# EAGLE design flight_unit (EAGLE 9.5.1)

## Sheet 1 of 6
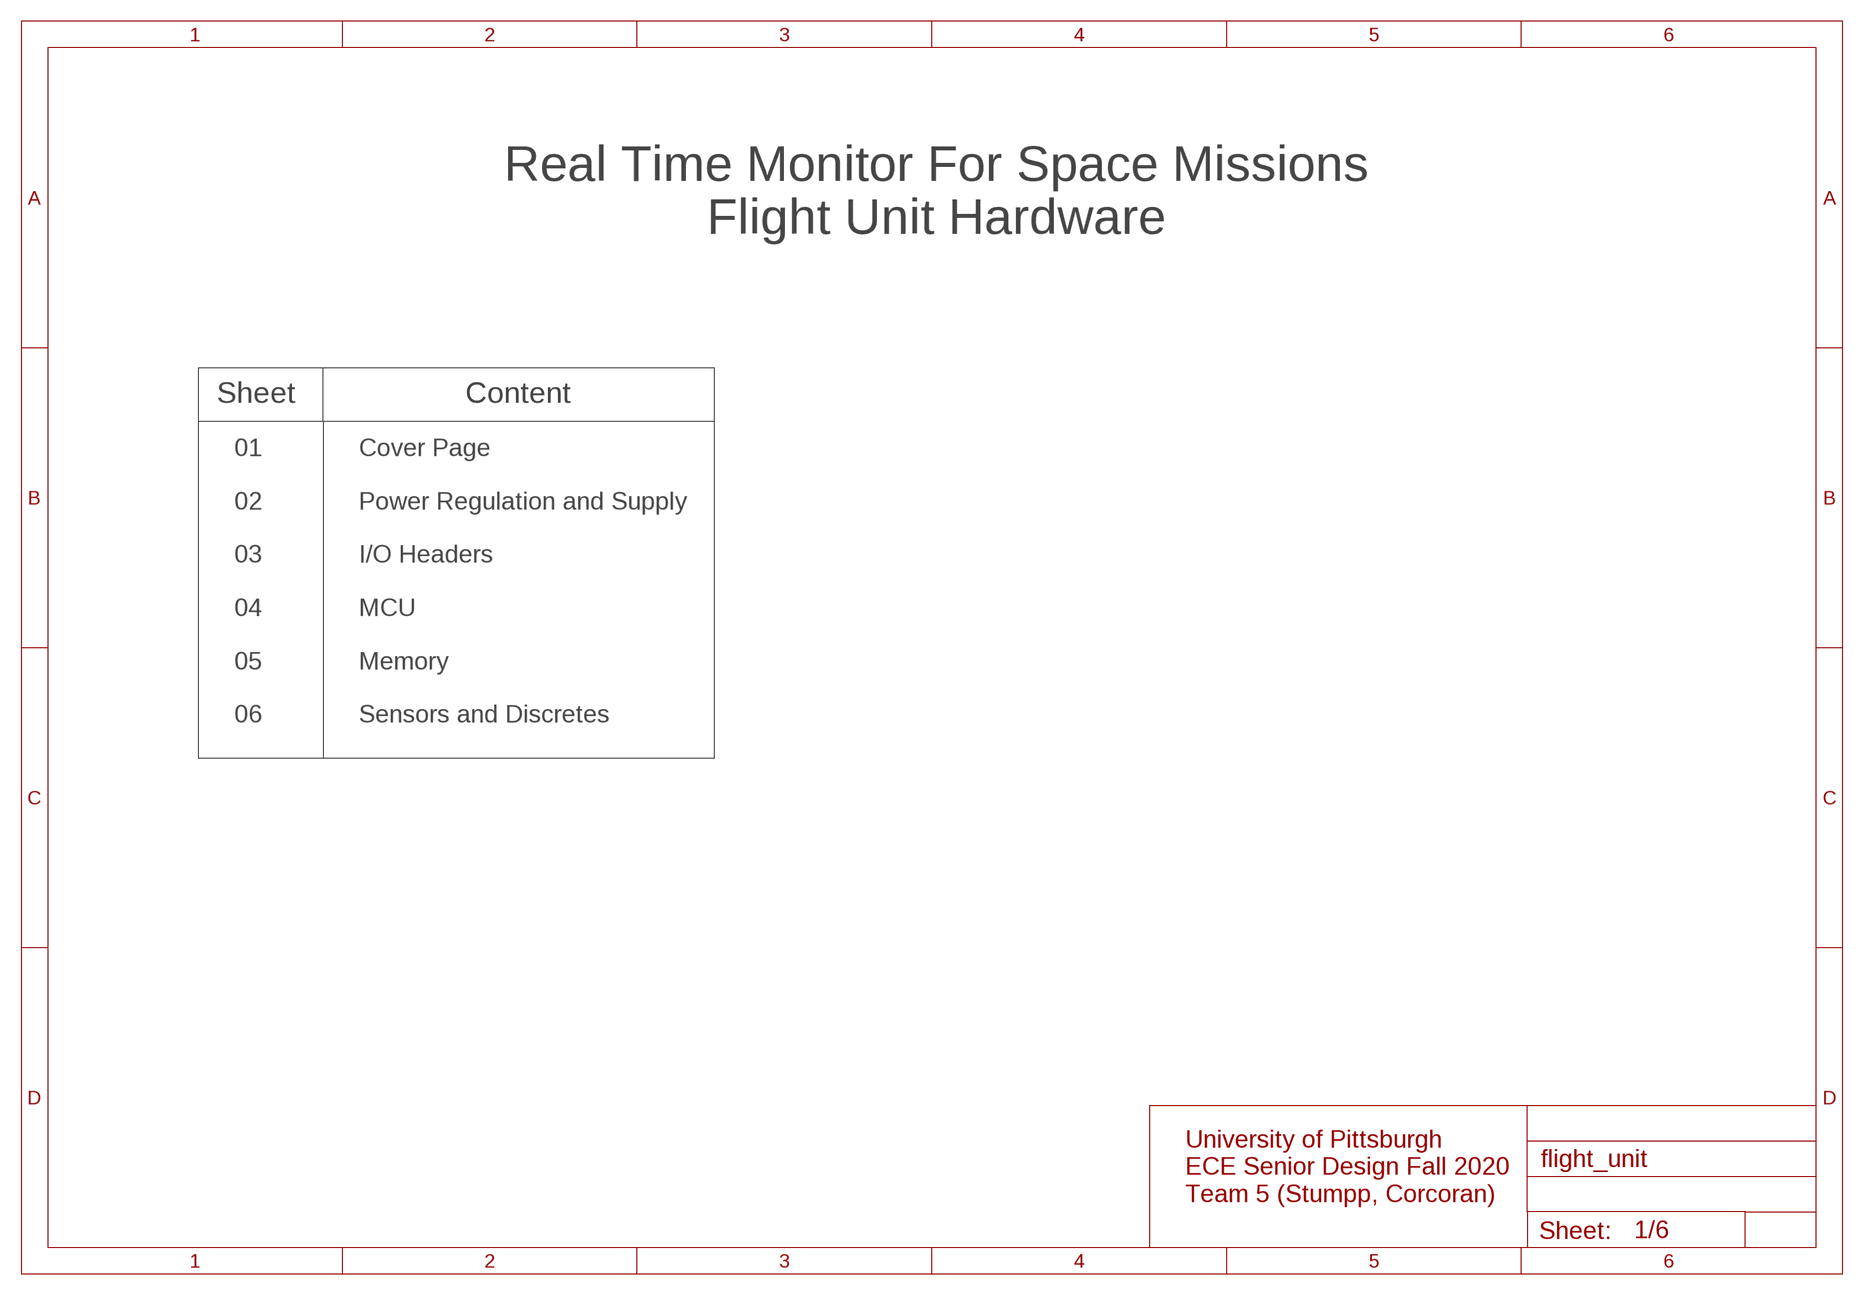
[diagram p0: schematic, sheet 1]

### Notes on the sheet
- Real Time Monitor For Space Missions
  Flight Unit Hardware
- Sheet | Content
- 01
  
  02
  
  03
  
  04
  
  05
  
  06
- Cover Page
  
  Power Regulation and Supply
  
  I/O Headers
  
  MCU
  
  Memory
  
  Sensors and Discretes
- University of Pittsburgh 
  ECE Senior Design Fall 2020
  Team 5 (Stumpp, Corcoran)

## Sheet 2 of 6
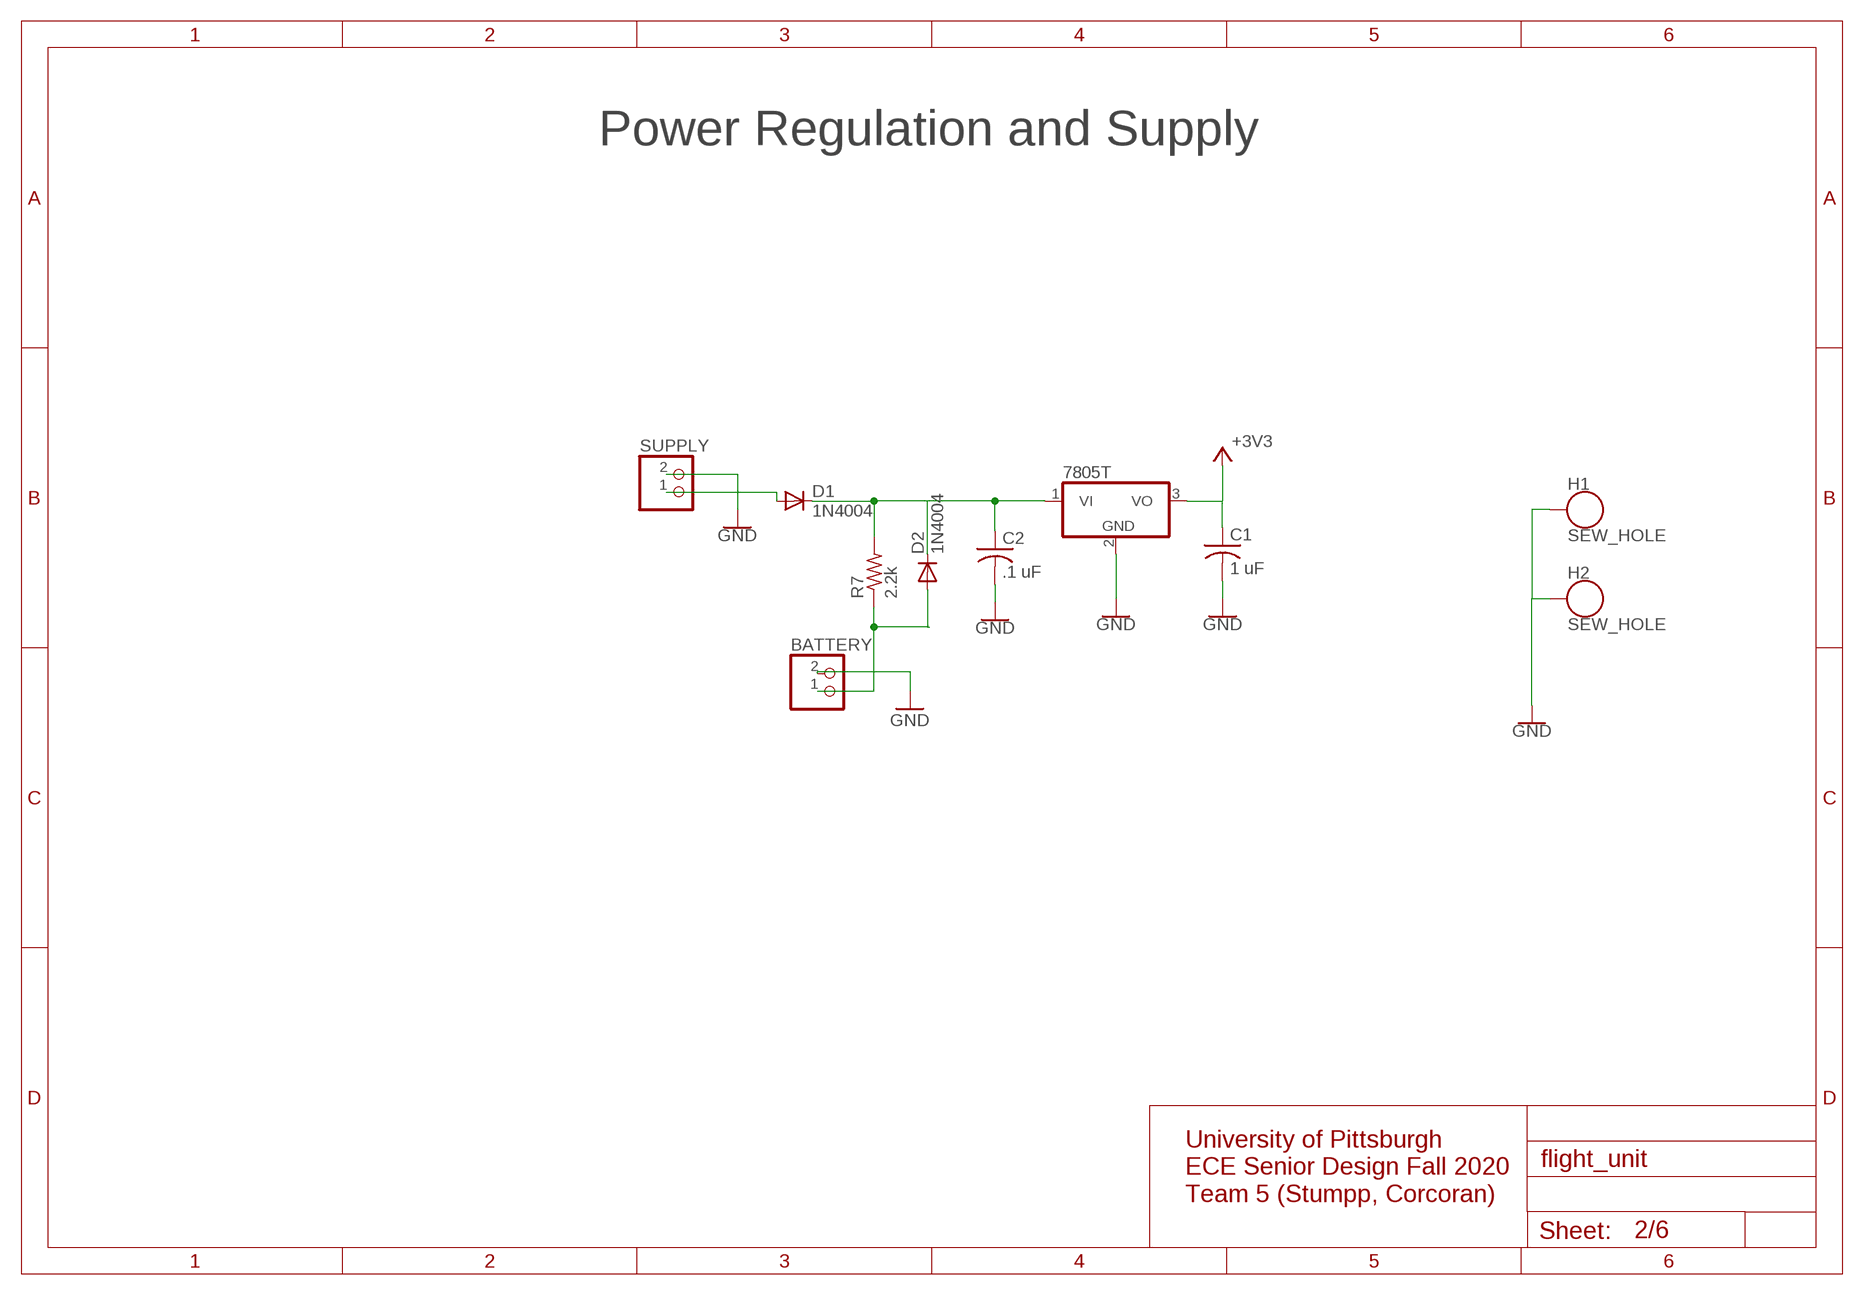
[diagram p1: schematic, sheet 2]

### Parts
BATTERY  JST_2PIN-THM  [JST-PH-2-THM]
C1  1 uF  C-USC0805K  [C0805K]
C2  .1 uF  C-USC0805K  [C0805K]
D1  1N4004  [DO41-10]
D2  1N4004  [DO41-10]
H1  SEW_HOLE  [SIMPLE_HOLE]
H2  SEW_HOLE  [SIMPLE_HOLE]
IC2  7805T  [TO220H]
R7  2.2k  R-US_R0805  [R0805]
SUPPLY  JST_2PIN-THM  [JST-PH-2-THM]

### Nets
+3V3: C1.1 IC2.3(VO) ; also sheet 4,5,6
GND: BATTERY.2 C1.2 C2.2 H1.P$1 H2.P$1 IC2.2(GND) SUPPLY.2 ; also sheet 3,4,5,6
N$1: BATTERY.1 D2.A R7.1
N$2: C2.1 D1.C D2.C IC2.1(VI) R7.2
N$4: D1.A SUPPLY.1

### Notes on the sheet
- Power Regulation and Supply
- University of Pittsburgh 
  ECE Senior Design Fall 2020
  Team 5 (Stumpp, Corcoran)

## Sheet 3 of 6
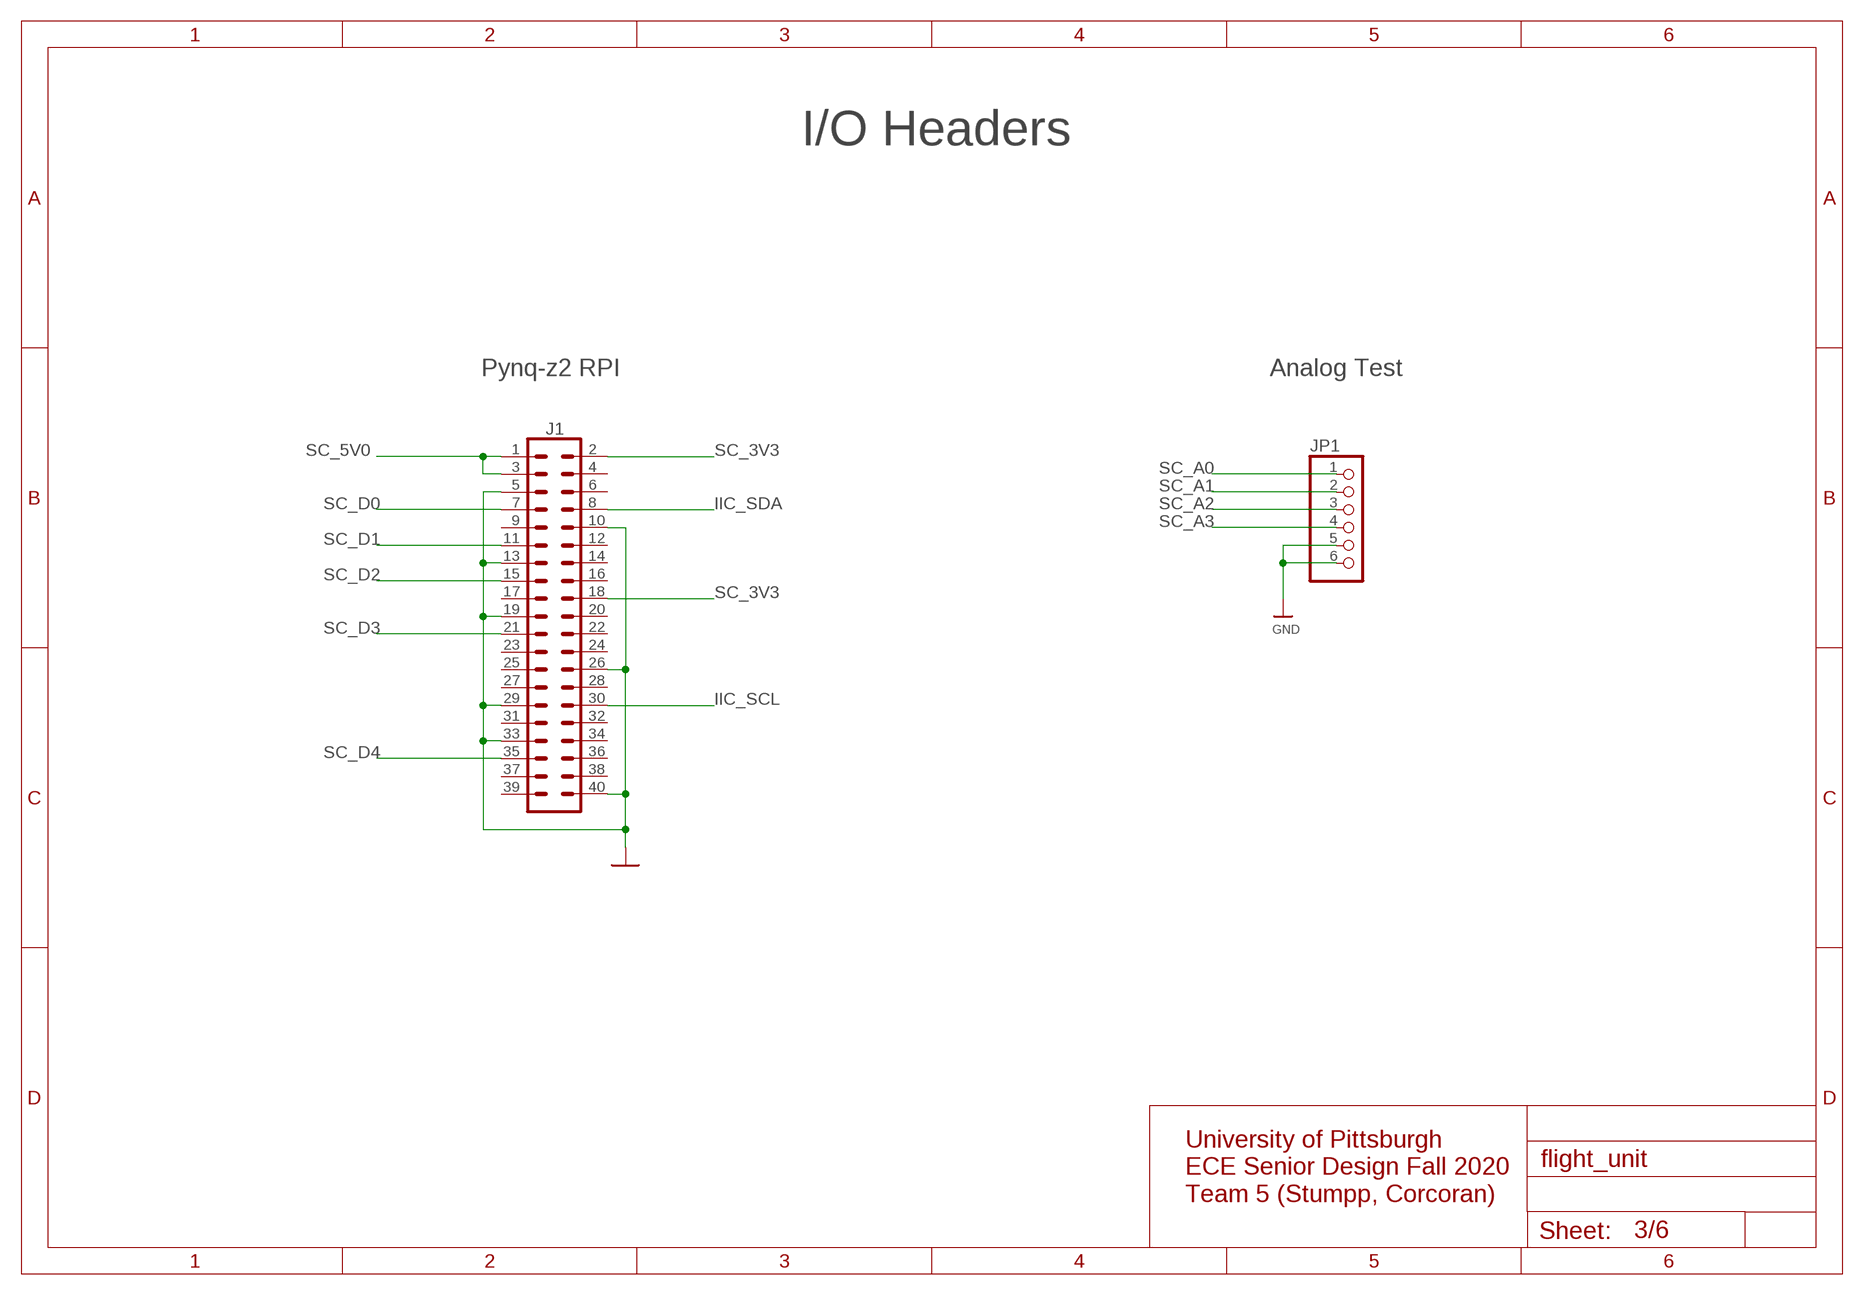
[diagram p2: schematic, sheet 3]

### Parts
J1  CONN_20X2SHROUDED  [2X20_SHROUDED]
JP1  PINHD-1X6B  [1X06-BIG]

### Nets
GND: J1.5 J1.10 J1.13 J1.19 J1.26 J1.29 J1.33 J1.40 JP1.5 JP1.6 ; also sheet 2,4,5,6
IIC_SCL: J1.30 ; also sheet 4,6
IIC_SDA: J1.8 ; also sheet 4,6
SC_3V3: J1.2 J1.18 ; also sheet 6
SC_5V0: J1.1 J1.3 ; also sheet 6
SC_A0: JP1.1 ; also sheet 6
SC_A1: JP1.2 ; also sheet 6
SC_A2: JP1.3 ; also sheet 6
SC_A3: JP1.4 ; also sheet 6
SC_D0: J1.7 ; also sheet 4
SC_D1: J1.11 ; also sheet 4
SC_D2: J1.15 ; also sheet 4
SC_D3: J1.21 ; also sheet 4
SC_D4: J1.35 ; also sheet 4
Unconnected: J1.4 J1.6 J1.9 J1.12 J1.14 J1.16 J1.17 J1.20 J1.22 J1.23 J1.24 J1.25 J1.27 J1.28 J1.31 J1.32 J1.34 J1.36 J1.37 J1.38 J1.39

### Notes on the sheet
- I/O Headers
- Pynq-z2 RPI | Analog Test
- University of Pittsburgh 
  ECE Senior Design Fall 2020
  Team 5 (Stumpp, Corcoran)

## Sheet 4 of 6
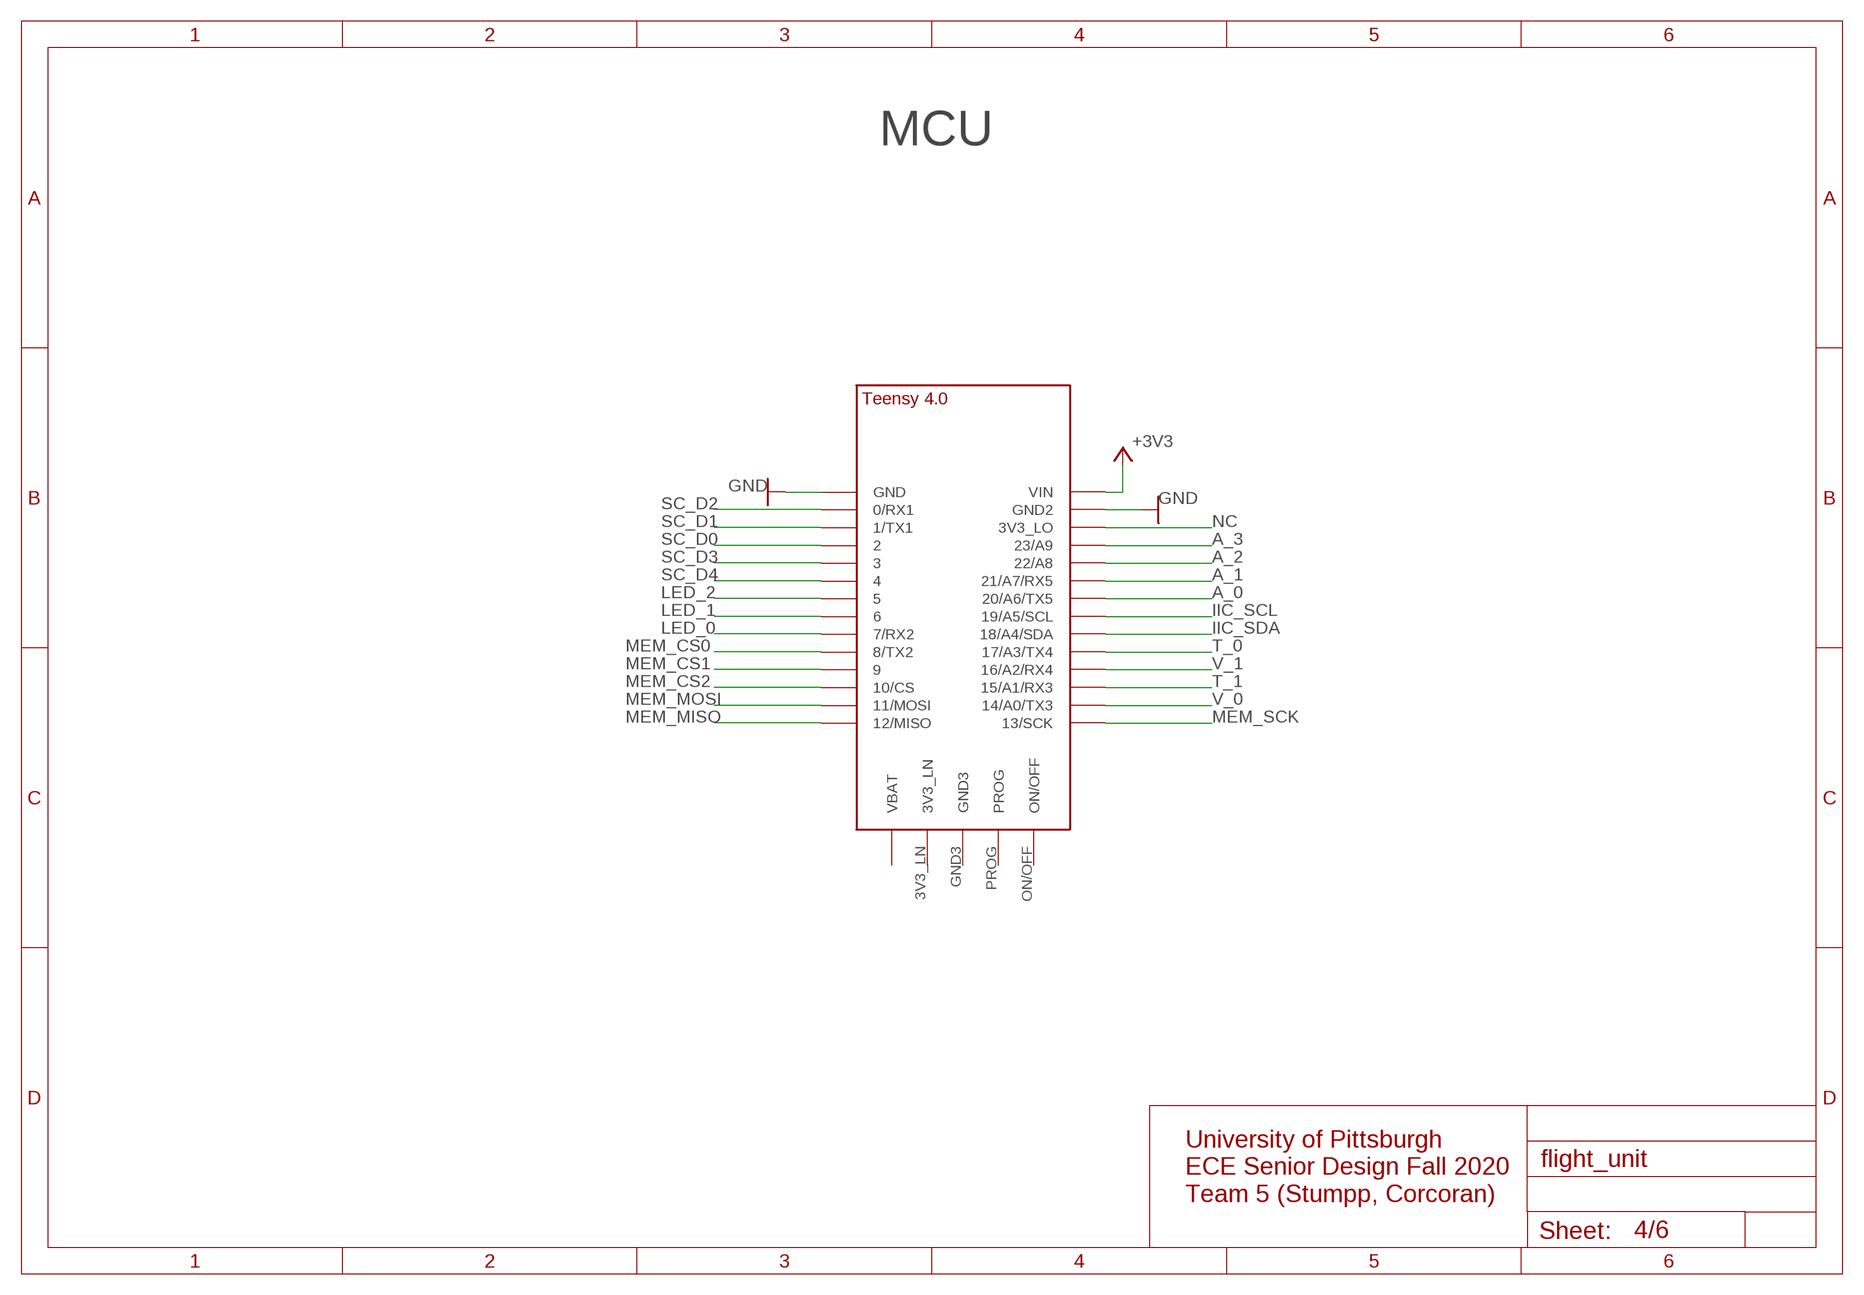
[diagram p3: schematic, sheet 4]

### Parts
U$1  TEENSY_4.0  [TEENSY_4.0]

### Nets
+3V3: U$1.VIN ; also sheet 2,5,6
A_0: U$1.20/A6(20/A6/TX5) ; also sheet 6
A_1: U$1.21/A7(21/A7/RX5) ; also sheet 6
A_2: U$1.22/A8 ; also sheet 6
A_3: U$1.23/A9 ; also sheet 6
GND: U$1.GND U$1.GND2 ; also sheet 2,3,5,6
IIC_SCL: U$1.19/A5/SCL ; also sheet 3,6
IIC_SDA: U$1.18/A4/SDA ; also sheet 3,6
LED_0: U$1.7(7/RX2) ; also sheet 6
LED_1: U$1.6 ; also sheet 6
LED_2: U$1.5 ; also sheet 6
MEM_CS0: U$1.8(8/TX2) ; also sheet 5
MEM_CS1: U$1.9/CS ; also sheet 5
MEM_CS2: U$1.10/CS ; also sheet 5
MEM_MISO: U$1.12/MISO ; also sheet 5
MEM_MOSI: U$1.11/MOSI ; also sheet 5
MEM_SCK: U$1.13/SCK ; also sheet 5
NC: U$1.3V3_LO
SC_D0: U$1.2 ; also sheet 3
SC_D1: U$1.1/TX(1/TX1) ; also sheet 3
SC_D2: U$1.0/RX(0/RX1) ; also sheet 3
SC_D3: U$1.3/CANTX ; also sheet 3
SC_D4: U$1.4/CANRX ; also sheet 3
T_0: U$1.17/A3(17/A3/TX4) ; also sheet 6
T_1: U$1.15/A1(15/A1/RX3) ; also sheet 6
V_0: U$1.14/A0(14/A0/TX3) ; also sheet 6
V_1: U$1.16/A2(16/A2/RX4) ; also sheet 6
Unconnected: U$1.3V3_LN U$1.GND3 U$1.ON/OFF U$1.PROG U$1.VBAT\(VBAT)

### Notes on the sheet
- MCU
- University of Pittsburgh 
  ECE Senior Design Fall 2020
  Team 5 (Stumpp, Corcoran)

## Sheet 5 of 6
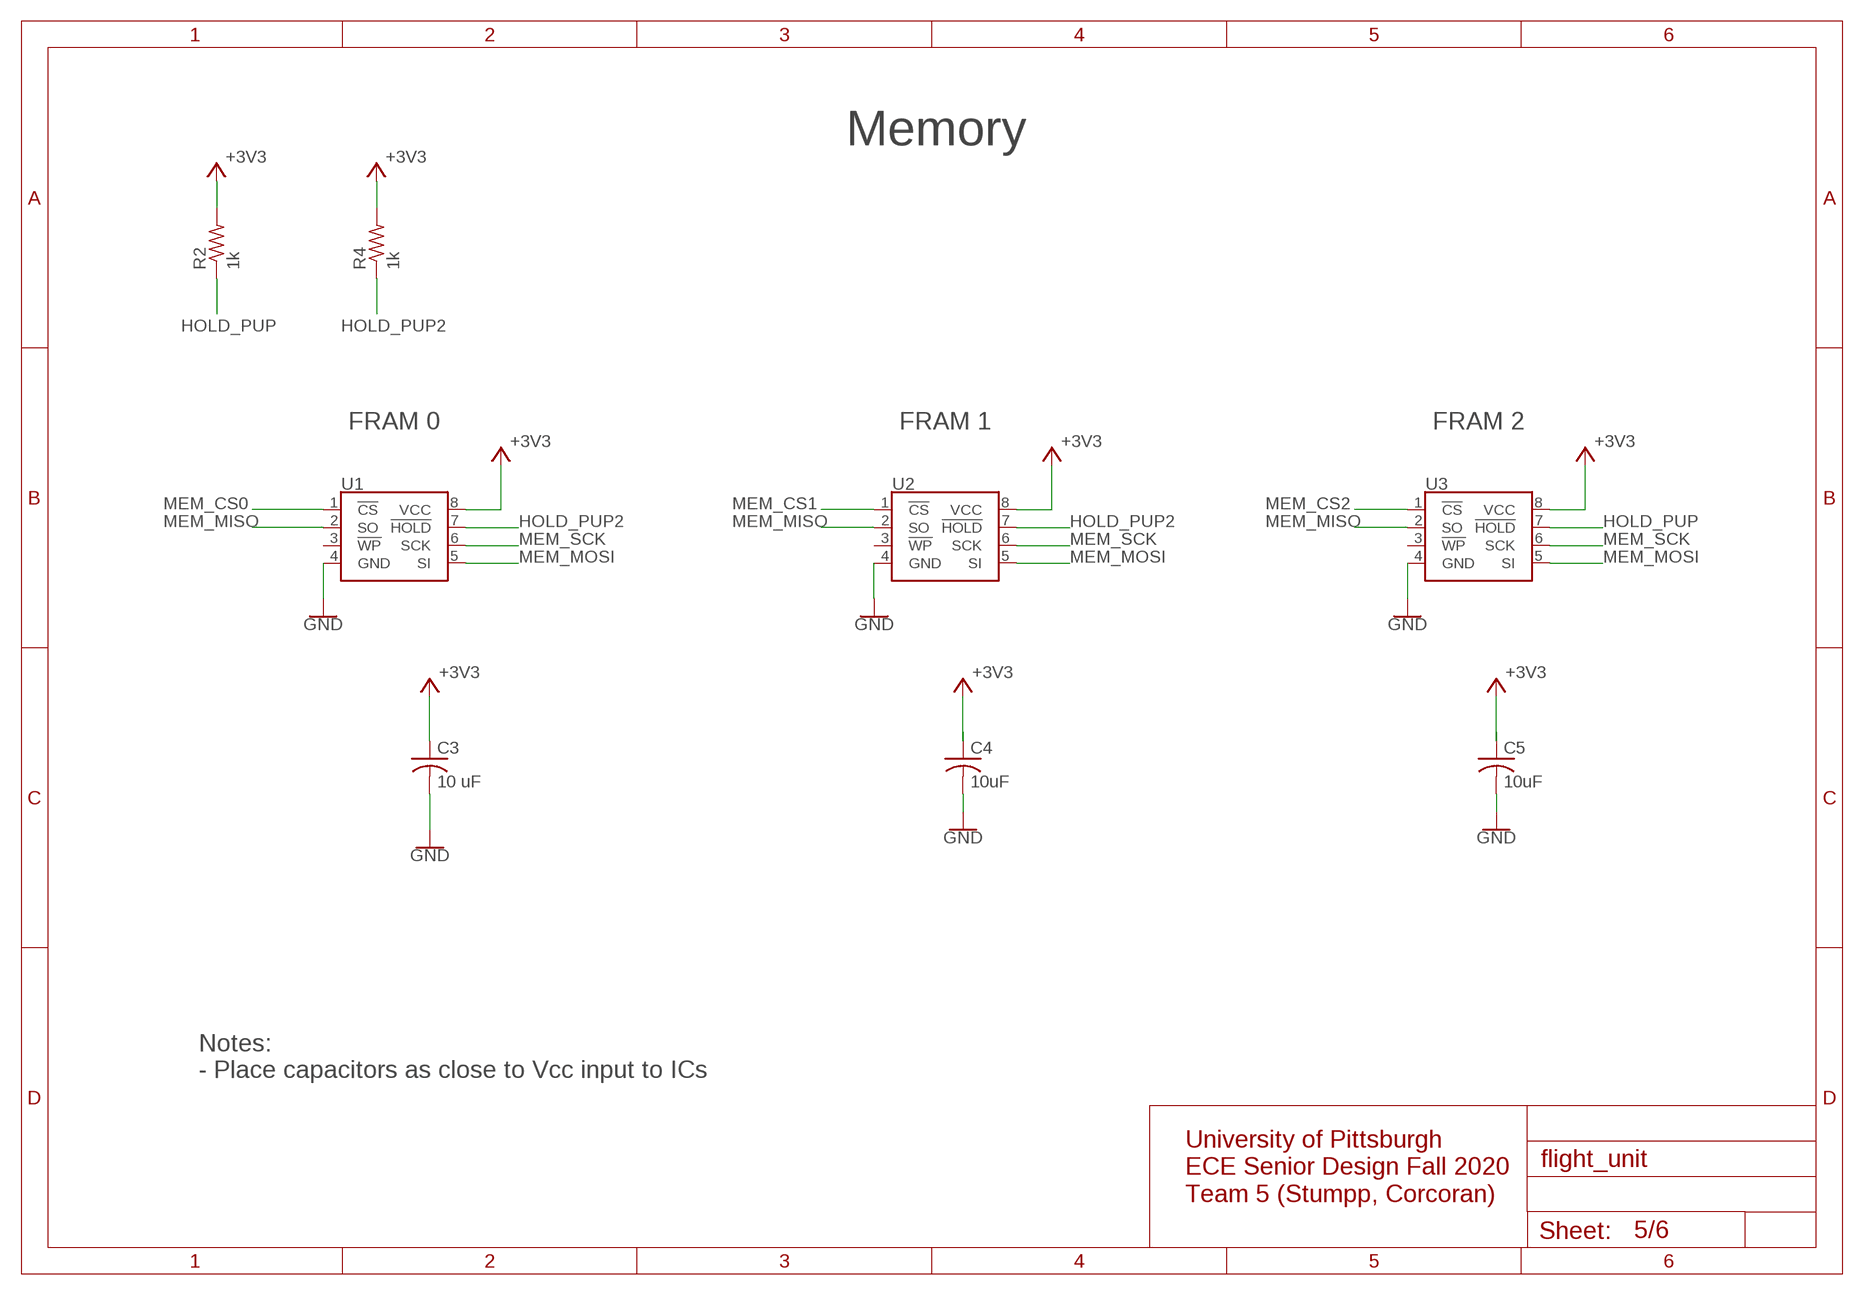
[diagram p4: schematic, sheet 5]

### Parts
C3  10 uF  C-USC0805K  [C0805K]
C4  10uF  C-USC0805K  [C0805K]
C5  10uF  C-USC0805K  [C0805K]
R2  1k  R-US_R0805  [R0805]
R4  1k  R-US_R0805  [R0805]
U1  4MB Flash  AT25SF041  [SO08]
U2  4MB Flash  AT25SF041  [SO08]
U3  4MB Flash  AT25SF041  [SO08]

### Nets
+3V3: C3.1 C4.1 C5.1 R2.2 R4.2 U1.8(VCC) U2.8(VCC) U3.8(VCC) ; also sheet 2,4,6
GND: C3.2 C4.2 C5.2 U1.4(GND) U2.4(GND) U3.4(GND) ; also sheet 2,3,4,6
HOLD_PUP: R2.1 U3.7(!HOLD)
HOLD_PUP2: R4.1 U1.7(!HOLD) U2.7(!HOLD)
MEM_CS0: U1.1(!CS) ; also sheet 4
MEM_CS1: U2.1(!CS) ; also sheet 4
MEM_CS2: U3.1(!CS) ; also sheet 4
MEM_MISO: U1.2(SO) U2.2(SO) U3.2(SO) ; also sheet 4
MEM_MOSI: U1.5(SI) U2.5(SI) U3.5(SI) ; also sheet 4
MEM_SCK: U1.6(SCK) U2.6(SCK) U3.6(SCK) ; also sheet 4
Unconnected: U1.3(!WP) U2.3(!WP) U3.3(!WP)

### Notes on the sheet
- Memory
- FRAM 0 | FRAM 1 | FRAM 2
- Notes:
  - Place capacitors as close to Vcc input to ICs
- University of Pittsburgh 
  ECE Senior Design Fall 2020
  Team 5 (Stumpp, Corcoran)

## Sheet 6 of 6
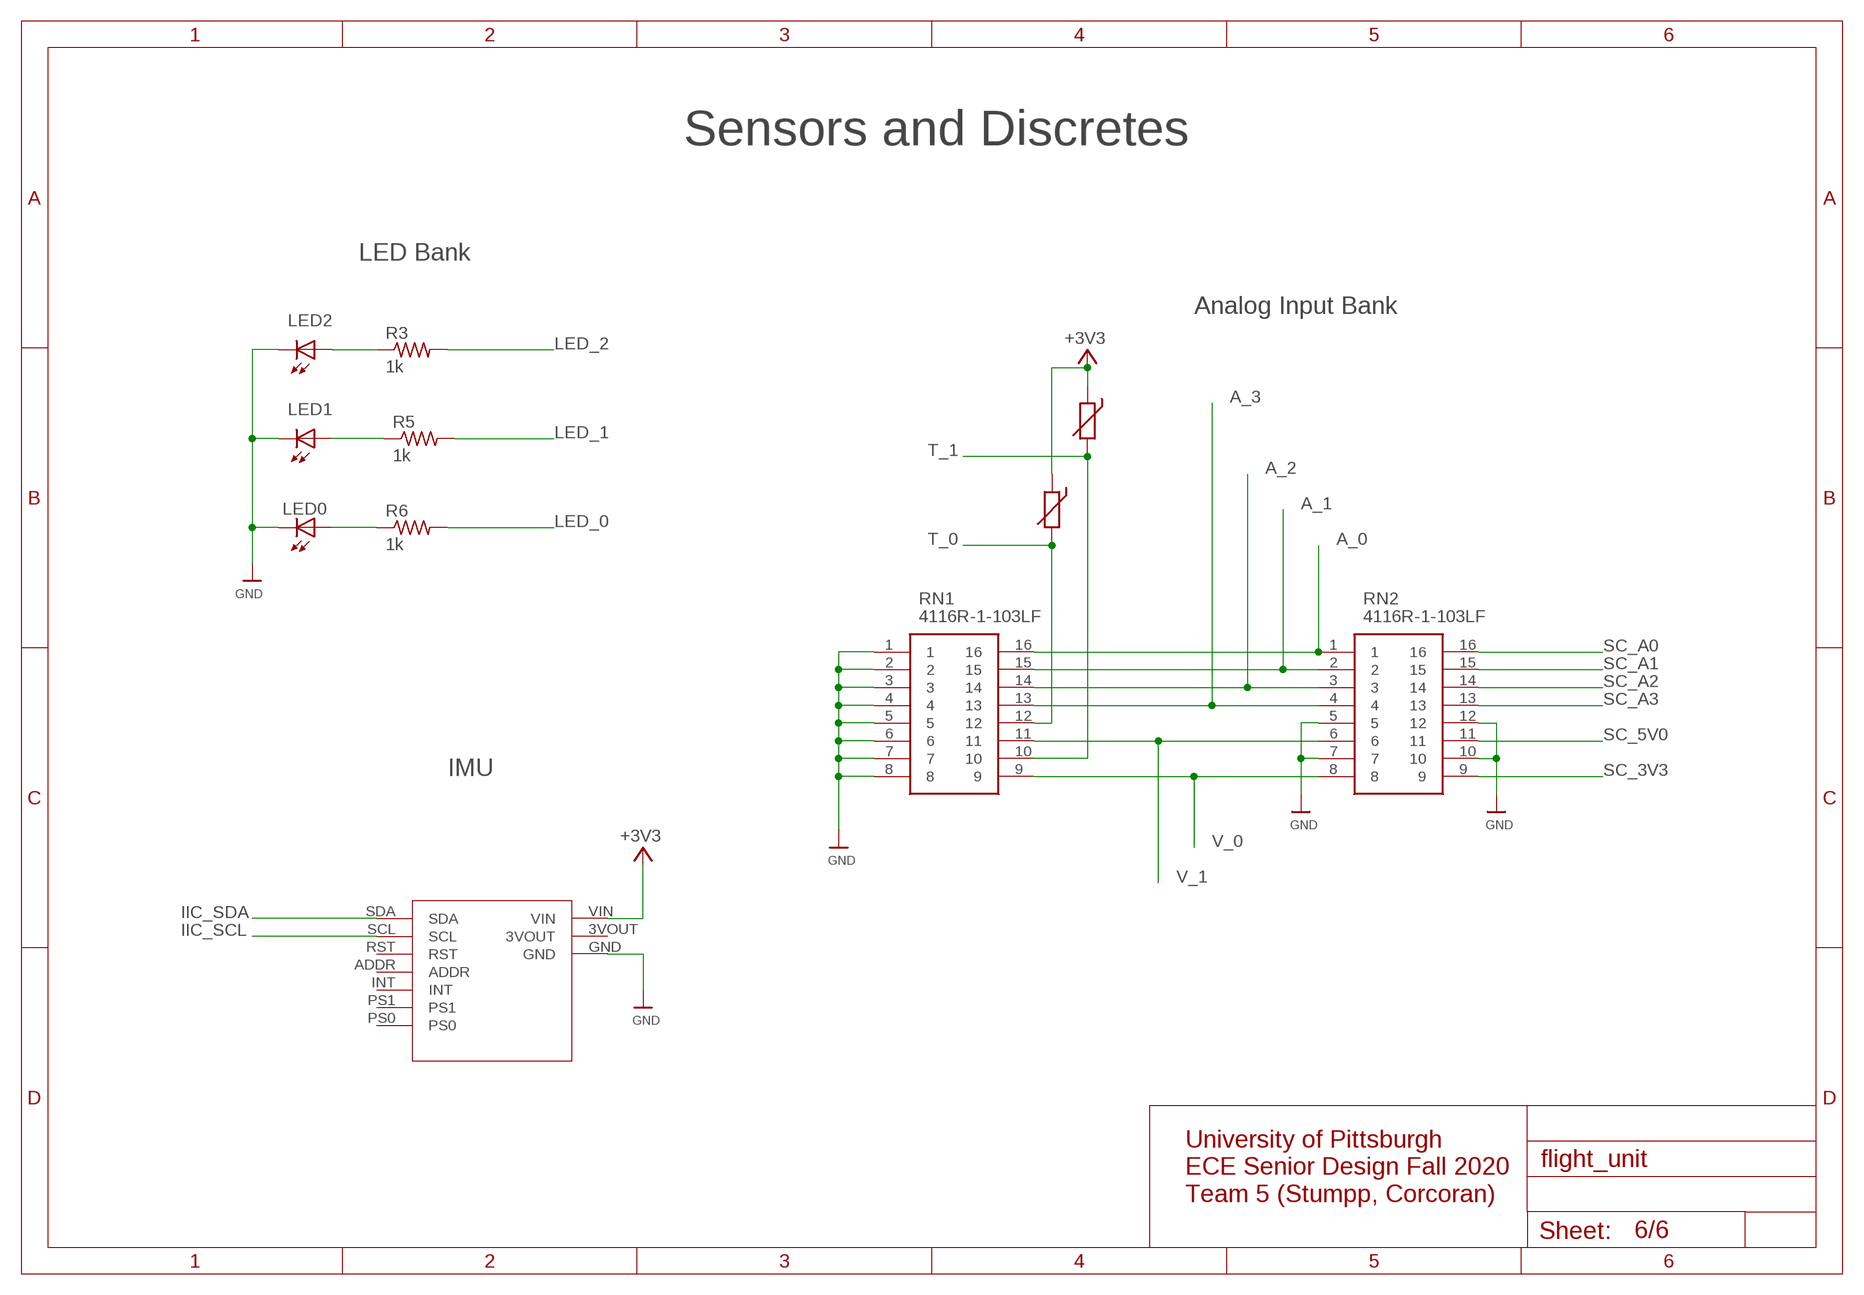
[diagram p5: schematic, sheet 6]

### Parts
LED0  LED3MM  [LED3MM]
LED1  LED3MM  [LED3MM]
LED2  LED3MM  [LED3MM]
R3  1k  R-US_R0805  [R0805]
R5  1k  R-US_R0805  [R0805]
R6  1k  R-US_R0805  [R0805]
R8  THERMISTOR-2,5  [RS-2,5]
RN1  4116R-1-103LF  [DIP787W49P254L2197H469Q16N]
RN2  4116R-1-103LF  [DIP787W49P254L2197H469Q16N]
T1  THERMISTOR-2,5  [RS-2,5]
U$3  IMU_BREAKOUT  [BNO055_BREAKOUT]

### Nets
+3V3: R8.1 T1.1 U$3.VIN ; also sheet 2,4,5
A_0: RN1.16 RN2.1 ; also sheet 4
A_1: RN1.15 RN2.2 ; also sheet 4
A_2: RN1.14 RN2.3 ; also sheet 4
A_3: RN1.13 RN2.4 ; also sheet 4
GND: LED0.K(C) LED1.K(C) LED2.K(C) RN1.1 RN1.2 RN1.3 RN1.4 RN1.5 RN1.6 RN1.7 RN1.8 RN2.5 RN2.7 RN2.10 RN2.12 U$3.GND ; also sheet 2,3,4,5
IIC_SCL: U$3.SCL ; also sheet 3,4
IIC_SDA: U$3.SDA ; also sheet 3,4
LED_0: R6.2 ; also sheet 4
LED_1: R5.2 ; also sheet 4
LED_2: R3.2 ; also sheet 4
N$3: LED2.A R3.1
N$7: LED0.A R6.1
N$8: LED1.A R5.1
SC_3V3: RN2.9 ; also sheet 3
SC_5V0: RN2.11 ; also sheet 3
SC_A0: RN2.16 ; also sheet 3
SC_A1: RN2.15 ; also sheet 3
SC_A2: RN2.14 ; also sheet 3
SC_A3: RN2.13 ; also sheet 3
T_0: R8.2 RN1.12 ; also sheet 4
T_1: RN1.10 T1.2 ; also sheet 4
V_0: RN1.9 RN2.8 ; also sheet 4
V_1: RN1.11 RN2.6 ; also sheet 4
Unconnected: U$3.3VOUT U$3.ADDR U$3.INT U$3.PS0 U$3.PS1 U$3.RST

### Notes on the sheet
- Sensors and Discretes
- LED Bank
- Analog Input Bank
- IMU
- University of Pittsburgh 
  ECE Senior Design Fall 2020
  Team 5 (Stumpp, Corcoran)

## Library data of the parts
BATTERY SUPPLY = adafruit:JST_2PIN: JST 2-Pin Connectors of various flavors SMT-RA (S2B-PH-SM4) 4UConnector #17311 SMT (B2B-PH-SM4) THM-RA (S2B-PH) THM (B2B-PH)
C1-C5 = adafruit:C-US: CAPACITOR, American symbol
D1 D2 = diode:1N4004: DIODE general purpose rectifier, 1 A
H1 H2 = SparkFun-Retired:SEW_HOLE: SparkFun LilyPad Sew Hole Simple sew-tap with .1" diameter hole with 20mil annular ring SparkFun Products: [PRODUCT 1] <[PRODUCT1LINK]> [PRODUCT 2] <PRODUCT2LINK> [PRODUCT 3] <PRODUCT3LINK>
IC2 = linear:78*: Positive VOLTAGE REGULATOR Source: http://cache.national.com/ds/LM/LM78L05.pdf http://www.fairchildsemi.com/ds/LM/LM7805.pdf
J1 = SparkFun-Connectors:CONN_20X2: Multi connection point. Often used as Generic Header-pin footprint for 0.1 inch spaced/style header connections On any of the 0.1 inch spaced packages, you can populate with these: Break Away Headers - Straight <https://www.sparkfun.com/products/116> (PRT-00116) Break Away Male Headers - Right Angle <https://www.sparkfun.com/products/553> (PRT-00553) Female Headers <https://www.sparkfun.com/products/115> (PRT-00115) Break Away Headers - Machine Pin <https://www.sparkfun.com/products/117> (PRT-00117) Break Away Female Headers - Swiss Machine Pin <https://www.sparkfun.com/products/743> (PRT-00743); PROD_ID: CONN-12263; SF_ID: CONN-12263
JP1 = adafruit:PINHD-1X6: PIN HEADER
LED0 LED1 LED2 = adafruit:LED: LED OSRAM: - CHIPLED LG R971, LG N971, LY N971, LG Q971, LY Q971, LO R971, LY R971 LH N974, LH R974 LS Q976, LO Q976, LY Q976 LO Q996 - Hyper CHIPLED LW Q18S LB Q993, LB Q99A, LB R99A - SideLED LS A670, LO A670, LY A670, LG A670, LP A670 LB A673, LV A673, LT A673, LW A673 LH A674 LY A675 LS A676, LA A676, LO A676, LY A676, LW A676 LS A679, LY A679, LG A679 - Hyper Micro SIDELED® LS Y876, LA Y876, LO Y876, LY Y876 LT Y87S - SmartLED LW L88C, LW L88S LB L89C, LB L89S, LG L890 LS L89K, LO L89K, LY L89K LS L896, LA L896, LO L896, LY L896 - TOPLED LS T670, LO T670, LY T670, LG T670, LP T670 LSG T670, LSP T670, LSY T670, LOP T670, LYG T670 LG T671, LOG T671, LSG T671 LB T673, LV T673, LT T673, LW T673 LH T674 LS T676, LA T676, LO T676, LY T676, LB T676, LH T676, LSB T676, LW T676 LB T67C, LV T67C, LT T67C, LS T67K, LO T67K, LY T67K, LW E67C LS E67B, LA E67B, LO E67B, LY E67B, LB E67C, LV E67C, LT E67C LW T67C LS T679, LY T679, LG T679 LS T770, LO T770, LY T770, LG T770, LP T770 LB T773, LV T773, LT T773, LW T773 LH T774 LS E675, LA E675, LY E675, LS T675 LS T776, LA T776, LO T776, LY T776, LB T776 LHGB T686 LT T68C, LB T68C - Hyper Mini TOPLED® LB M676 - Mini TOPLED Santana® LG M470 LS M47K, LO M47K, LY M47K Source: http://www.osram.convergy.de/
R2-R7 = adafruit:R-US_: RESISTOR, American symbol
R8 = varistor:THERMISTOR: THERMISTOR; SPICEPREFIX: R
RN1 RN2 = SamacSys_Parts:4116R-1-103LF: Bourns Isolated Resistor Array 10k +/-2% 8 Resistors, 2.25W Total, DIP package 4100R Through Hole Source: Datasheet <http://www.bourns.com/pdfs/4100R.pdf>; DESCRIPTION: Bourns Isolated Resistor Array 10k +/-2% 8 Resistors, 2.25W Total, DIP package 4100R Through Hole; HEIGHT: 4.69mm; MANUFACTURER_NAME: Bourns; MANUFACTURER_PART_NUMBER: 4116R-1-103LF; MOUSER_PART_NUMBER: 652-4116R-1LF-10K; MOUSER_PRICE-STOCK: https://www.mouser.co.uk/ProductDetail/Bourns/4116R-1-103LF?qs=jew24QT47erdvJ3qcVRaMA%3D%3D
T1 = varistor:THERMISTOR: THERMISTOR
U1-U3 = SparkFun-IC-Memory:AT25SF041: AT25SF041 4Mb Serial Flash Memory 104MHz, SPI, 8-SOIC Datasheet <http://www.adestotech.com/wp-content/uploads/DS-AT25SF041_044.pdf> SparkFun Products: SparkFun ESP8266 Thing <https://www.sparkfun.com/products/13231> SparkFun ESP8266 Thing - Dev Board <https://www.sparkfun.com/products/13711>; PROD_ID: IC-12455
U$1 = TEENSY 4.0:TEENSY_4.0
U$3 = adafruit:IMU_BREAKOUT

## Board
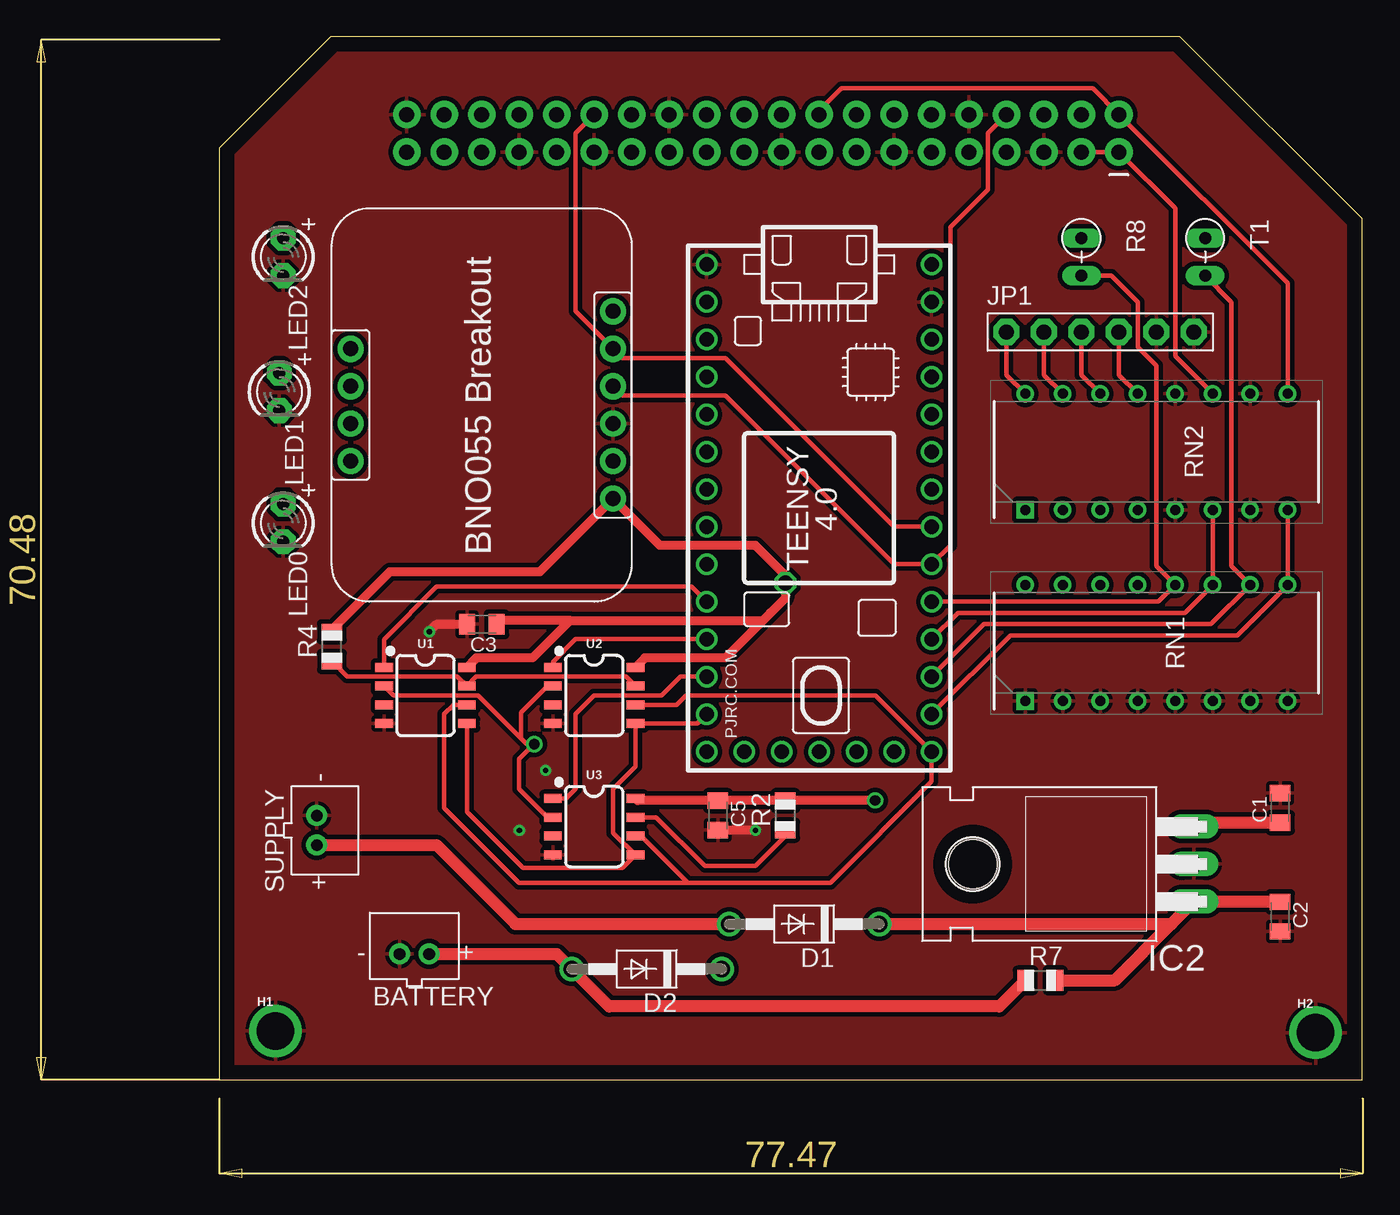
[diagram p6: board, top side]
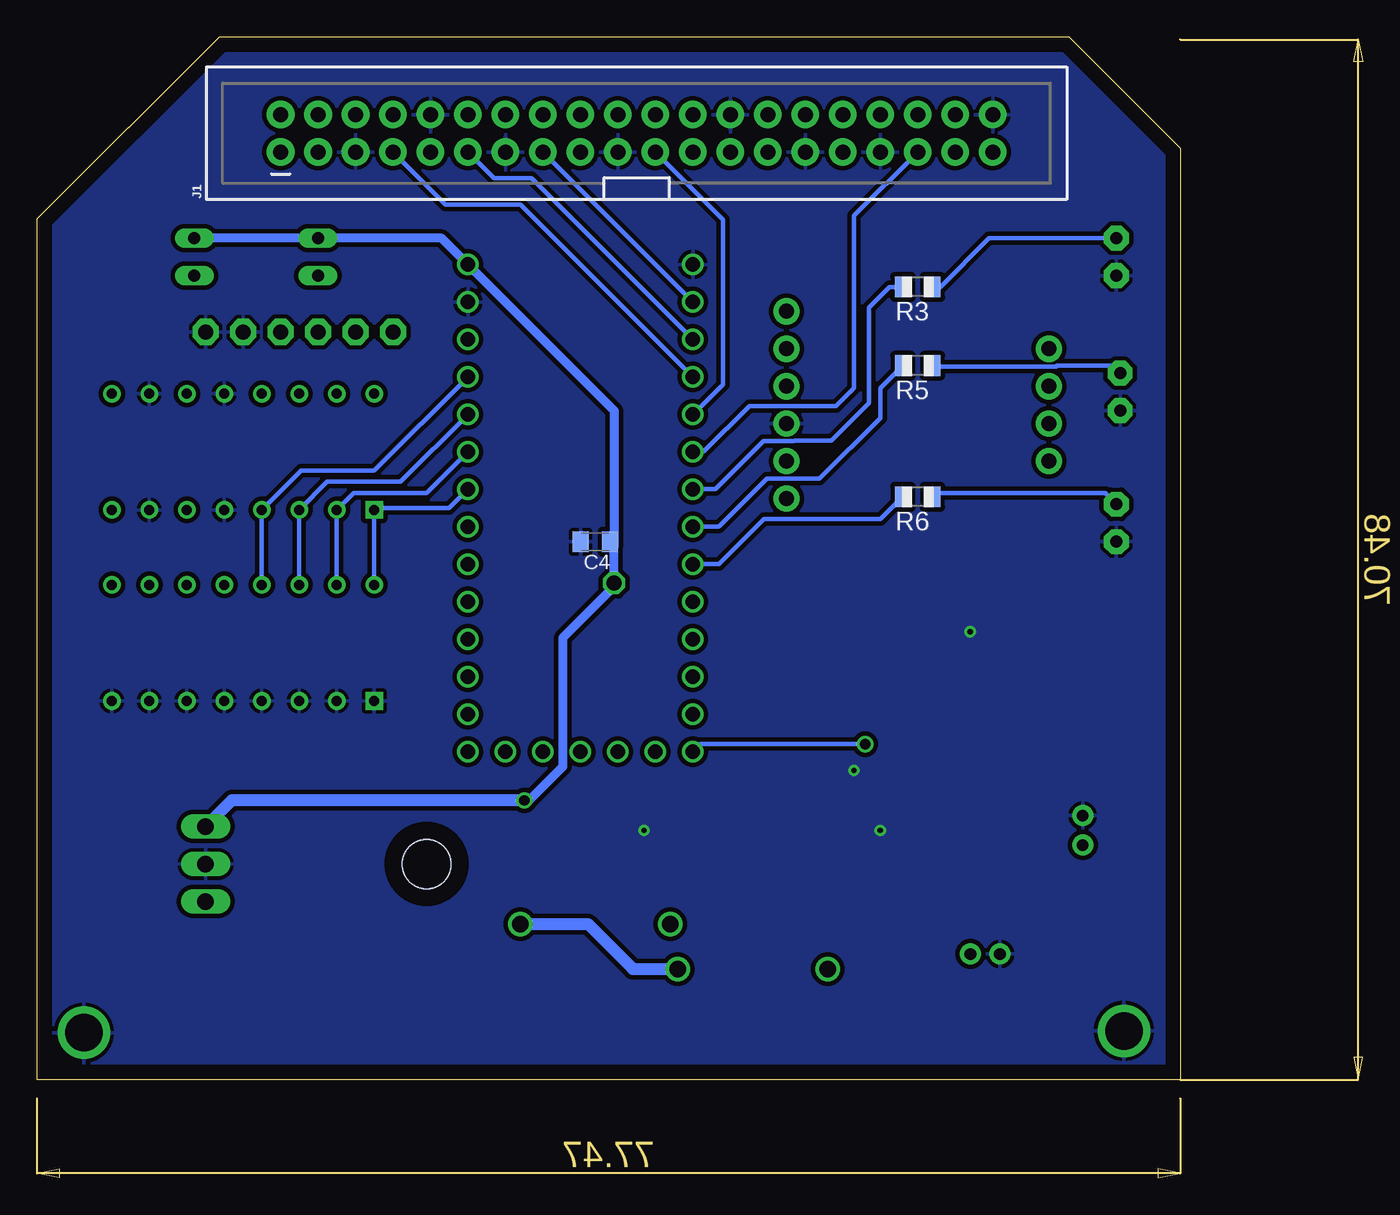
[diagram p7: board, bottom side, seen from below]

Size 77.45 x 70.66 mm. Coordinates in mm from the lower left corner, seen from the top.
Outline: 0,0 77.45,0 77.43,58.33 65.1,70.66 7.54,70.66 0,63.12 0,0
Copper layers (1*16): Top 0.035mm / dielectric 1.5mm / Bottom 0.035mm
Design rules "default": minimum track width 6mil, minimum drill 0.35mm, track to track 6mil, track to pad 6mil, pad to pad 6mil, via to via 6mil, smd to smd 6mil, copper to edge 40mil, drill to drill 6mil, minimum pad ring 10mil, minimum via ring 8mil, stop-mask expansion 4mil, vias tented up to drill 0mil, thermal gap 10mil

### Footprints (pad centres in the part's own frame; a part is rotated, then mirrored left to right if it is on the bottom)
JST-PH-2-THM = drill 0.8 pad 1.422: 1 1,0; 2 -1,0
C0805K = smd 1.1 x 1.4: 1 -1,0; 2 1,0
DO41-10 = drill 1.118: A 5.08,0; C -5.08,0
SIMPLE_HOLE = drill 2.54 pad 3.048: P$1 0,0
TO220H = drill 1.118 long: 1 -2.54,-10.16; 2 0,-10.16; 3 2.54,-10.16 | hole 3.302: 0,4.826
2X20_SHROUDED = drill 1.016 pad 1.88: 1 -1.27,24.13; 2 1.27,24.13; 3 -1.27,21.59; 4 1.27,21.59; 5 -1.27,19.05; 6 1.27,19.05; 7 -1.27,16.51; 8 1.27,16.51; 9 -1.27,13.97; 10 1.27,13.97; 11 -1.27,11.43; 12 1.27,11.43; 13 -1.27,8.89; 14 1.27,8.89; 15 -1.27,6.35; 16 1.27,6.35; 17 -1.27,3.81; 18 1.27,3.81; 19 -1.27,1.27; 20 1.27,1.27; 21 -1.27,-1.27; 22 1.27,-1.27; 23 -1.27,-3.81; 24 1.27,-3.81; 25 -1.27,-6.35; 26 1.27,-6.35; 27 -1.27,-8.89; 28 1.27,-8.89; 29 -1.27,-11.43; 30 1.27,-11.43; 31 -1.27,-13.97; 32 1.27,-13.97; 33 -1.27,-16.51; 34 1.27,-16.51; 35 -1.27,-19.05; 36 1.27,-19.05; 37 -1.27,-21.59; 38 1.27,-21.59; 39 -1.27,-24.13; 40 1.27,-24.13
1X06-BIG = drill 1.016 pad 1.778 octagon: 1 -6.35,0; 2 -3.81,0; 3 -1.27,0; 4 1.27,0; 5 3.81,0; 6 6.35,0
LED3MM = drill 0.813 pad 1.676 octagon: A -1.27,0; K 1.27,0
R0805 = smd 1.1 x 1.4: 1 -1,0; 2 1,0
RS-2,5 = drill 0.813 long: 1 -1.27,0; 2 1.27,0
DIP787W49P254L2197H469Q16N = drill 0.688 pad 1.088 square: 1 -3.935,8.89 | drill 0.688 pad 1.088: 2 -3.935,6.35; 3 -3.935,3.81; 4 -3.935,1.27; 5 -3.935,-1.27; 6 -3.935,-3.81; 7 -3.935,-6.35; 8 -3.935,-8.89; 9 3.935,-8.89; 10 3.935,-6.35; 11 3.935,-3.81; 12 3.935,-1.27; 13 3.935,1.27; 14 3.935,3.81; 15 3.935,6.35; 16 3.935,8.89
SO08 = smd 0.6 x 1.2: 1 -1.905,-2.8; 2 -0.635,-2.8; 3 0.635,-2.8; 4 1.905,-2.8; 5 1.905,2.8; 6 0.635,2.8; 7 -0.635,2.8; 8 -1.905,2.8
TEENSY_4.0 = drill 0.965: 0/RX -13.97,-7.62; 1/TX -11.43,-7.62; 2 -8.89,-7.62; 3/CANTX -6.35,-7.62; 3V3_LN 16.51,-2.54; 3V3_LO -11.43,7.62; 4/CANRX -3.81,-7.62; 5 -1.27,-7.62; 6 1.27,-7.62; 7 3.81,-7.62; 8 6.35,-7.62; 9/CS 8.89,-7.62; 10/CS 11.43,-7.62; 11/MOSI 13.97,-7.62; 12/MISO 16.51,-7.62; 13/SCK 16.51,7.62; 14/A0 13.97,7.62; 15/A1 11.43,7.62; 16/A2 8.89,7.62; 17/A3 6.35,7.62; 18/A4/SDA 3.81,7.62; 19/A5/SCL 1.27,7.62; 20/A6 -1.27,7.62; 21/A7 -3.81,7.62; 22/A8 -6.35,7.62; 23/A9 -8.89,7.62; GND -16.51,-7.62; GND2 -13.97,7.62; GND3 16.51,0; ON/OFF 16.51,5.08; PROG 16.51,2.54; VBAT\ 16.51,-5.08; VIN -16.51,7.62
BNO055_BREAKOUT = drill 1.016 pad 1.778: 3VOUT 9.525,1.27; ADDR 17.145,19.05; GND 12.065,1.27; INT 14.605,19.05; PS0 9.525,19.05; PS1 12.065,19.05; RST 19.685,1.27; SCL 17.145,1.27; SDA 14.605,1.27; VIN 6.985,1.27

### Placement (x,y rotation side)
BATTERY  13.21,8.51 0 top
C1  71.88,18.41 90 top
C2  71.88,11.05 270 top
C3  17.78,30.86 180 top
C4  39.62,36.45 180 bottom
C5  33.78,17.91 270 top
D1  39.62,10.54 180 top
D2  28.96,7.49 180 top
H1  3.81,3.3 0 top
H2  74.3,3.17 0 top
IC2  55.88,14.61 90 top
J1  36.83,64.14 90 bottom
JP1  59.69,50.67 0 top
LED0  4.32,37.72 270 top
LED1  4.06,46.61 270 top
LED2  4.32,55.75 270 top
R2  38.35,17.91 90 top
R3  17.78,53.72 180 bottom
R4  7.62,29.34 90 top
R5  17.78,48.39 180 bottom
R6  17.78,39.5 180 bottom
R7  55.63,6.73 0 top
R8  58.42,55.75 270 top
RN1  63.5,29.59 90 top
RN2  63.5,42.55 90 top
SUPPLY  6.6,16.89 270 top
T1  66.8,55.75 270 top
U1  13.97,26.04 270 top
U2  25.4,26.04 270 top
U3  25.4,17.14 270 top
U$1  40.64,38.73 270 top
U$3  27.94,32.38 90 top

### Tracks (layer width: path | path; a pad name or v marks a point on that pad's centre or on a via)
+3V3  (via drill 0.7, 1)
  Top 0.305: 38.35,34.16 v38.35,33.66
  Top 0.508: 36.83,31.11 37.34,31.62
  Top 0.61: v38.35,33.66 38.35,32.64 37.34,31.62 34.29,28.57 28.84,28.57 U2.8 | 23.75,31.11 21.21,28.57 17.41,28.57 U1.8 | 23.75,31.11 36.83,31.11 | 38.35,34.16 36.32,36.2 29.84,36.2 U$3.VIN 21.72,34.42 11.55,34.42 7.62,30.48 R4.2 | U3.8 28.34,18.91 C5.1 R2.2 38.37,18.92 v44.45,18.92 | 23.75,31.11 19.03,31.11 C3.1
  Top 0.813: IC2.3 66.31,17.41 C1.1
  Bottom 0.61: T1.1 R8.1 50.04,57.02 U$1.VIN 38.35,45.34 38.35,36.18 | 38.35,36.18 v38.35,33.66 38.35,33.4 41.83,29.92 41.83,21.19 44.1,18.92 v44.45,18.92 | 38.35,36.18 C4.1
  Bottom 0.813: IC2.3 64.26,18.92 v44.45,18.92
A_0
  Bottom 0.305: U$1.20/A6 49.53,38.73 54.48,38.73 RN2.1 RN1.16
A_1
  Bottom 0.305: U$1.21/A7 51.05,39.75 56.01,39.75 RN2.2 RN1.15
A_2
  Bottom 0.305: U$1.22/A8 52.83,40.51 57.79,40.51 RN2.3 RN1.14
A_3
  Bottom 0.305: U$1.23/A9 54.61,41.27 59.56,41.27 RN2.4 RN1.13
GND  (via drill 0.35)
  Top 0.61: v36.32,16.89 33.8,16.89 C5.2 | v14.22,30.35 14.73,30.86 C3.2
  other vias: 20.32,16.89 22.1,20.95
  pour Top (isolate 0.305): 0,71.75 77.47,71.75 77.47,0 0,0
  pour Bottom (isolate 0.305): 0,71.75 77.47,71.75 77.47,0 0,0
HOLD_PUP
  Top 0.305: U3.7 29.59,17.78 32.9,14.47 36.32,14.47 38.35,16.51 R2.1
HOLD_PUP2
  Top 0.305: U2.7 27.57,27.3 17.41,27.3 U1.7 16.11,27.34 8.67,27.34 7.66,28.34 R4.1
IIC_SCL
  Top 0.305: U$1.19/A5/SCL 45.72,37.47 34.29,48.9 27.3,48.9 U$3.SCL 24.13,52.07 24.13,64.14 J1.30
IIC_SDA
  Top 0.305: U$3.SDA 27.3,46.35 34.29,46.35 45.72,34.92 U$1.18/A4/SDA 49.53,36.2 49.53,57.78 52.07,60.33 52.07,64.14 J1.8
LED_0
  Bottom 0.305: U$1.7 31.24,34.92 28.19,37.97 20.3,37.97 R6.2
LED_1
  Bottom 0.305: U$1.6 31.24,37.47 27.99,40.72 24.43,40.72 20.3,44.85 20.3,46.86 R5.2
LED_2
  Bottom 0.305: U$1.5 31.5,40.01 28.25,43.26 26.18,43.26 26.12,43.31 23.62,43.31 21.08,45.85 21.08,52.33 19.69,53.72 R3.2
MEM_CS0
  Top 0.305: U$1.8 32,33.4 14.73,33.4 11.17,29.84 U1.1
MEM_CS1
  Top 0.305: U$1.9/CS 24.13,29.84 22.6,28.32 U2.1
MEM_CS2
  Top 0.305: U$1.10/CS 31.24,27.3 29.97,26.04 25.4,26.04 24.13,24.77 24.13,19.68 23.5,19.05 U3.1
MEM_MISO  (via drill 0.7)
  Top 0.305: U2.2 22.23,26.67 20.45,24.89 20.45,23.11 | U3.2 22.23,17.78 20.32,19.68 20.32,21.72 v21.34,22.73 20.83,22.73 20.45,23.11 | 20.45,23.11 17.53,26.04 11.8,26.04 U1.2
  Bottom 0.305: U$1.12/MISO 32.51,22.73 v21.34,22.73
MEM_MOSI
  Top 0.305: U$1.11/MOSI 32.38,24.13 U2.5 28.2,21.21 26.67,19.68 26.67,16.71 27.47,15.9 27.54,15.9 U3.5 27.31,14.35 20.57,14.35 16.77,18.16 U1.5
MEM_SCK
  Top 0.305: U2.6 30.99,25.4 31.63,26.04 44.45,26.04 U$1.13/SCK 48.26,20.19 41.4,13.34 31.75,13.34 | 31.75,13.34 20.32,13.34 15.24,18.41 15.24,24.77 15.88,25.4 U1.6 | U3.6 28.57,16.51 31.75,13.34
N$1
  Top 0.813: R7.1 52.85,4.95 26.42,4.95 D2.A 22.86,8.51 BATTERY.1
N$2
  Top 0.813: D1.C 64.52,10.54 | 64.52,10.54 IC2.1 71.87,12.06 C2.1 | R7.2 60.71,6.73 64.52,10.54
  Bottom 0.813: D1.C 40.13,10.54 37.08,7.49 D2.C
N$3
  Bottom 0.305: R3.1 16.26,53.72 12.95,57.02 LED2.A
N$4
  Top 0.813: SUPPLY.1 14.72,15.89 20.07,10.54 D1.A
N$7
  Bottom 0.305: LED0.A 5.08,39.75 16.53,39.75 R6.1
N$8
  Bottom 0.305: LED1.A 4.57,48.39 8.35,48.39 8.4,48.34 16.73,48.34 R5.1
SC_3V3
  Top 0.305: RN2.9 72.39,53.98 J1.2 59.18,67.18 42.16,67.18 40.64,65.66 J1.18
SC_5V0
  Top 0.305: RN2.11 64.77,49.02 64.77,59.05 J1.1 J1.3
SC_A0
  Top 0.305: RN2.16 53.34,47.75 JP1.1
SC_A1
  Top 0.305: RN2.15 55.88,47.75 JP1.2
SC_A2
  Top 0.305: RN2.14 58.42,47.75 JP1.3
SC_A3
  Top 0.305: RN2.13 60.96,47.75 JP1.4
SC_D0
  Bottom 0.305: U$1.2 44.7,59.31 49.78,59.31 J1.7
SC_D1
  Bottom 0.305: U$1.1/TX 43.94,61.09 46.48,61.09 J1.11
SC_D2
  Bottom 0.305: U$1.0/RX J1.15
SC_D3
  Bottom 0.305: U$1.3/CANTX 30.99,47.12 30.99,58.29 J1.21
SC_D4
  Bottom 0.305: U$1.4/CANRX 32.3,42.55 29.2,45.64 23.32,45.64 22.1,46.86 22.1,58.55 J1.35
T_0
  Top 0.305: U$1.17/A3 63.63,32.38 RN1.12 63.5,34.8 63.5,48.39 62.23,49.66 62.23,52.7 60.45,54.48 R8.2
T_1
  Top 0.305: U$1.15/A1 51.82,30.86 67.19,30.86 RN1.10 68.58,34.8 68.58,52.7 T1.2
V_0
  Top 0.305: U$1.14/A0 53.59,30.1 68.96,30.1 RN1.9 RN2.8
V_1
  Top 0.305: U$1.16/A2 50.04,31.62 65.41,31.62 RN1.11 RN2.6